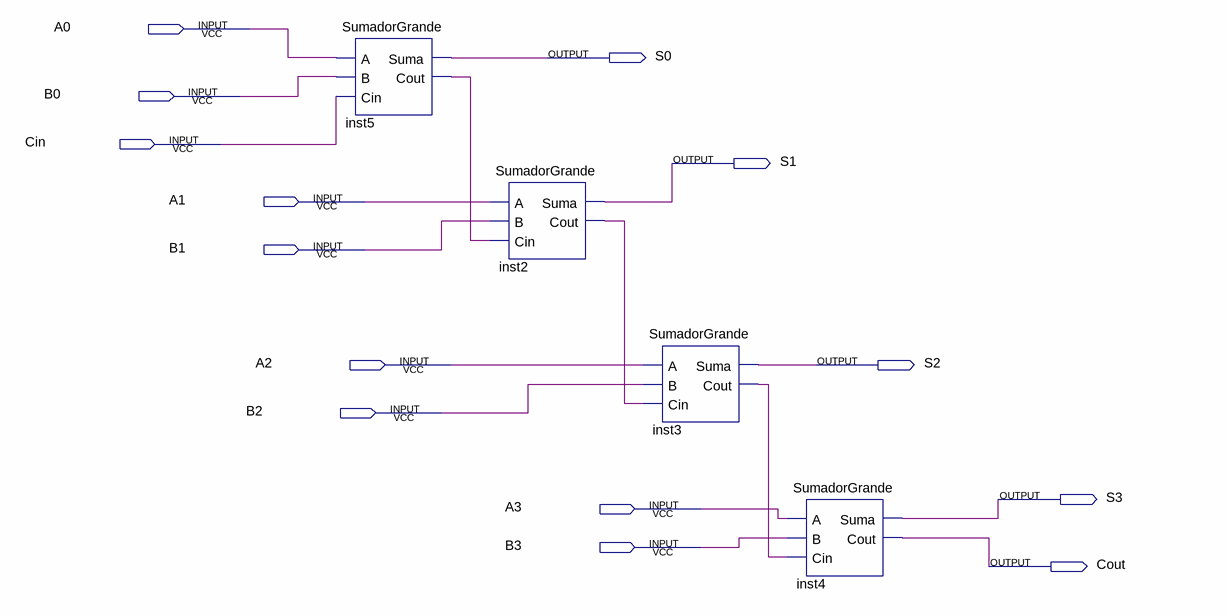
[diagram p0: schematic sheet]
// Quartus schematic Sumador4bits.bdf as structural Verilog: 4 symbols, 14 pins
module Sumador4bits (
  input  A0,
  input  B0,
  input  Cin,
  input  A1,
  input  B1,
  input  A2,
  input  B2,
  input  A3,
  input  B3,
  output S0,
  output S1,
  output S2,
  output S3,
  output Cout
);

  wire inst2_cout, inst3_cout, inst5_cout;

  SumadorGrande inst5 (.A(A0), .B(B0), .Cin(Cin), .Suma(S0), .Cout(inst5_cout));
  SumadorGrande inst2 (.A(A1), .B(B1), .Cin(inst5_cout), .Suma(S1), .Cout(inst2_cout));
  SumadorGrande inst3 (.A(A2), .B(B2), .Cin(inst2_cout), .Suma(S2), .Cout(inst3_cout));
  SumadorGrande inst4 (.A(A3), .B(B3), .Cin(inst3_cout), .Suma(S3), .Cout(Cout));
endmodule
